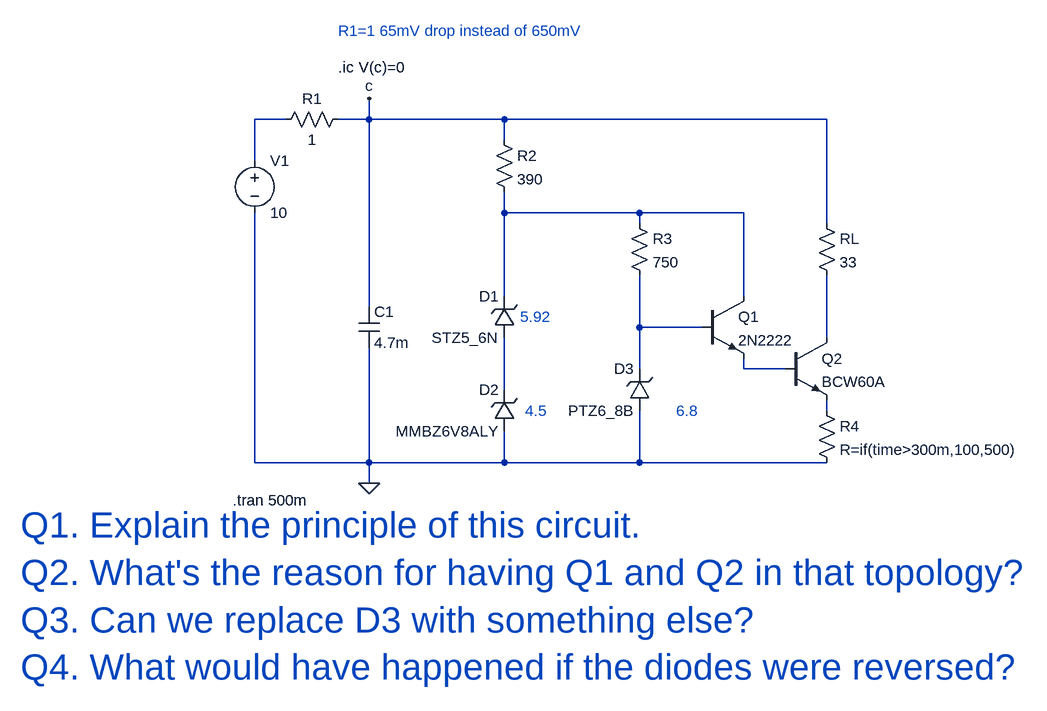
[diagram p0: schematic Interview01.asc]
Interview01.asc, the LTspice schematic file:
Version 4
SHEET 1 1808 1000
WIRE -48 128 -96 128
WIRE 80 128 80 96
WIRE 80 128 32 128
WIRE 288 128 80 128
WIRE 784 128 288 128
WIRE 288 160 288 128
WIRE -96 192 -96 128
WIRE 288 272 288 240
WIRE 496 272 288 272
WIRE 656 272 496 272
WIRE 496 288 496 272
WIRE 784 288 784 128
WIRE 288 400 288 272
WIRE 656 400 656 272
WIRE 80 416 80 128
WIRE 496 448 496 368
WIRE 592 448 496 448
WIRE 784 464 784 368
WIRE 496 512 496 448
WIRE 656 512 656 496
WIRE 720 512 656 512
WIRE 288 544 288 464
WIRE 784 576 784 560
WIRE -96 656 -96 272
WIRE 80 656 80 480
WIRE 80 656 -96 656
WIRE 288 656 288 608
WIRE 288 656 80 656
WIRE 496 656 496 576
WIRE 496 656 288 656
WIRE 784 656 496 656
WIRE 80 688 80 656
FLAG 80 688 0
FLAG 80 96 c
SYMBOL voltage -96 176 R0
SYMATTR InstName V1
SYMATTR Value 10
SYMBOL res 48 112 R90
WINDOW 0 0 56 VBottom 2
WINDOW 3 32 56 VTop 2
SYMATTR InstName R1
SYMATTR Value 1
SYMBOL cap 64 416 R0
SYMATTR InstName C1
SYMATTR Value 4.7m
SYMBOL res 272 144 R0
SYMATTR InstName R2
SYMATTR Value 390
SYMBOL zener 304 464 R180
WINDOW 0 24 64 Left 2
WINDOW 3 24 0 Left 2
SYMATTR InstName D1
SYMATTR Value STZ5_6N
SYMATTR Description Diode
SYMATTR Type diode
SYMBOL zener 304 608 R180
WINDOW 0 24 64 Left 2
WINDOW 3 24 0 Left 2
SYMATTR InstName D2
SYMATTR Value MMBZ6V8ALY
SYMATTR Description Diode
SYMATTR Type diode
SYMBOL res 480 272 R0
SYMATTR InstName R3
SYMATTR Value 750
SYMBOL zener 512 576 R180
WINDOW 0 24 64 Left 2
WINDOW 3 24 0 Left 2
SYMATTR InstName D3
SYMATTR Value PTZ6_8B
SYMATTR Description Diode
SYMATTR Type diode
SYMBOL npn 592 400 R0
SYMATTR InstName Q1
SYMATTR Value 2N2222
SYMBOL npn 720 464 R0
SYMATTR InstName Q2
SYMATTR Value BCW60A
SYMBOL res 768 560 R0
SYMATTR InstName R4
SYMATTR Value R=if(time>300m,100,500)
SYMBOL res 768 272 R0
SYMATTR InstName RL
SYMATTR Value 33
TEXT 312 432 Left 2 ;5.92
TEXT 320 576 Left 2 ;4.5
TEXT -130 714 Left 2 !.tran 500m
TEXT 552 576 Left 2 ;6.8
TEXT -456 752 Left 5 ;Q1. Explain the principle of this circuit.\nQ2. What's the reason for having Q1 and Q2 in that topology?\nQ3. Can we replace D3 with something else?\nQ4. What would have happened if the diodes were reversed?
TEXT 32 48 Left 2 !.ic V(c)=0
TEXT 32 -8 Left 2 ;R1=1 65mV drop instead of 650mV

The netlist it stands for:
* Interview01.asc
V1 N001 0 10
R1 c N001 1
C1 c 0 4.7m
R2 c N002 390
D1 N006 N002 STZ5_6N
D2 0 N006 MMBZ6V8ALY
R3 N002 N003 750
D3 0 N003 PTZ6_8B
Q1 N002 N003 N005 0 2N2222
Q2 N004 N005 N007 0 BCW60A
R4 N007 0 R=if(time>300m,100,500)
RL c N004 33
.model D D
.lib standard.dio
.model NPN NPN
.model PNP PNP
.lib standard.bjt
* 5.92
* 4.5
.tran 500m
* 6.8
* Q1. Explain the principle of this circuit.
* Q2. What's the reason for having Q1 and Q2 in that topology?
* Q3. Can we replace D3 with something else?
* Q4. What would have happened if the diodes were reversed?
.ic V(c)=0
* R1=1 65mV drop instead of 650mV
.backanno
.end